# EAGLE schematic TwoMegCoCo_MMU_v1.1 (EAGLE 7.7.0)
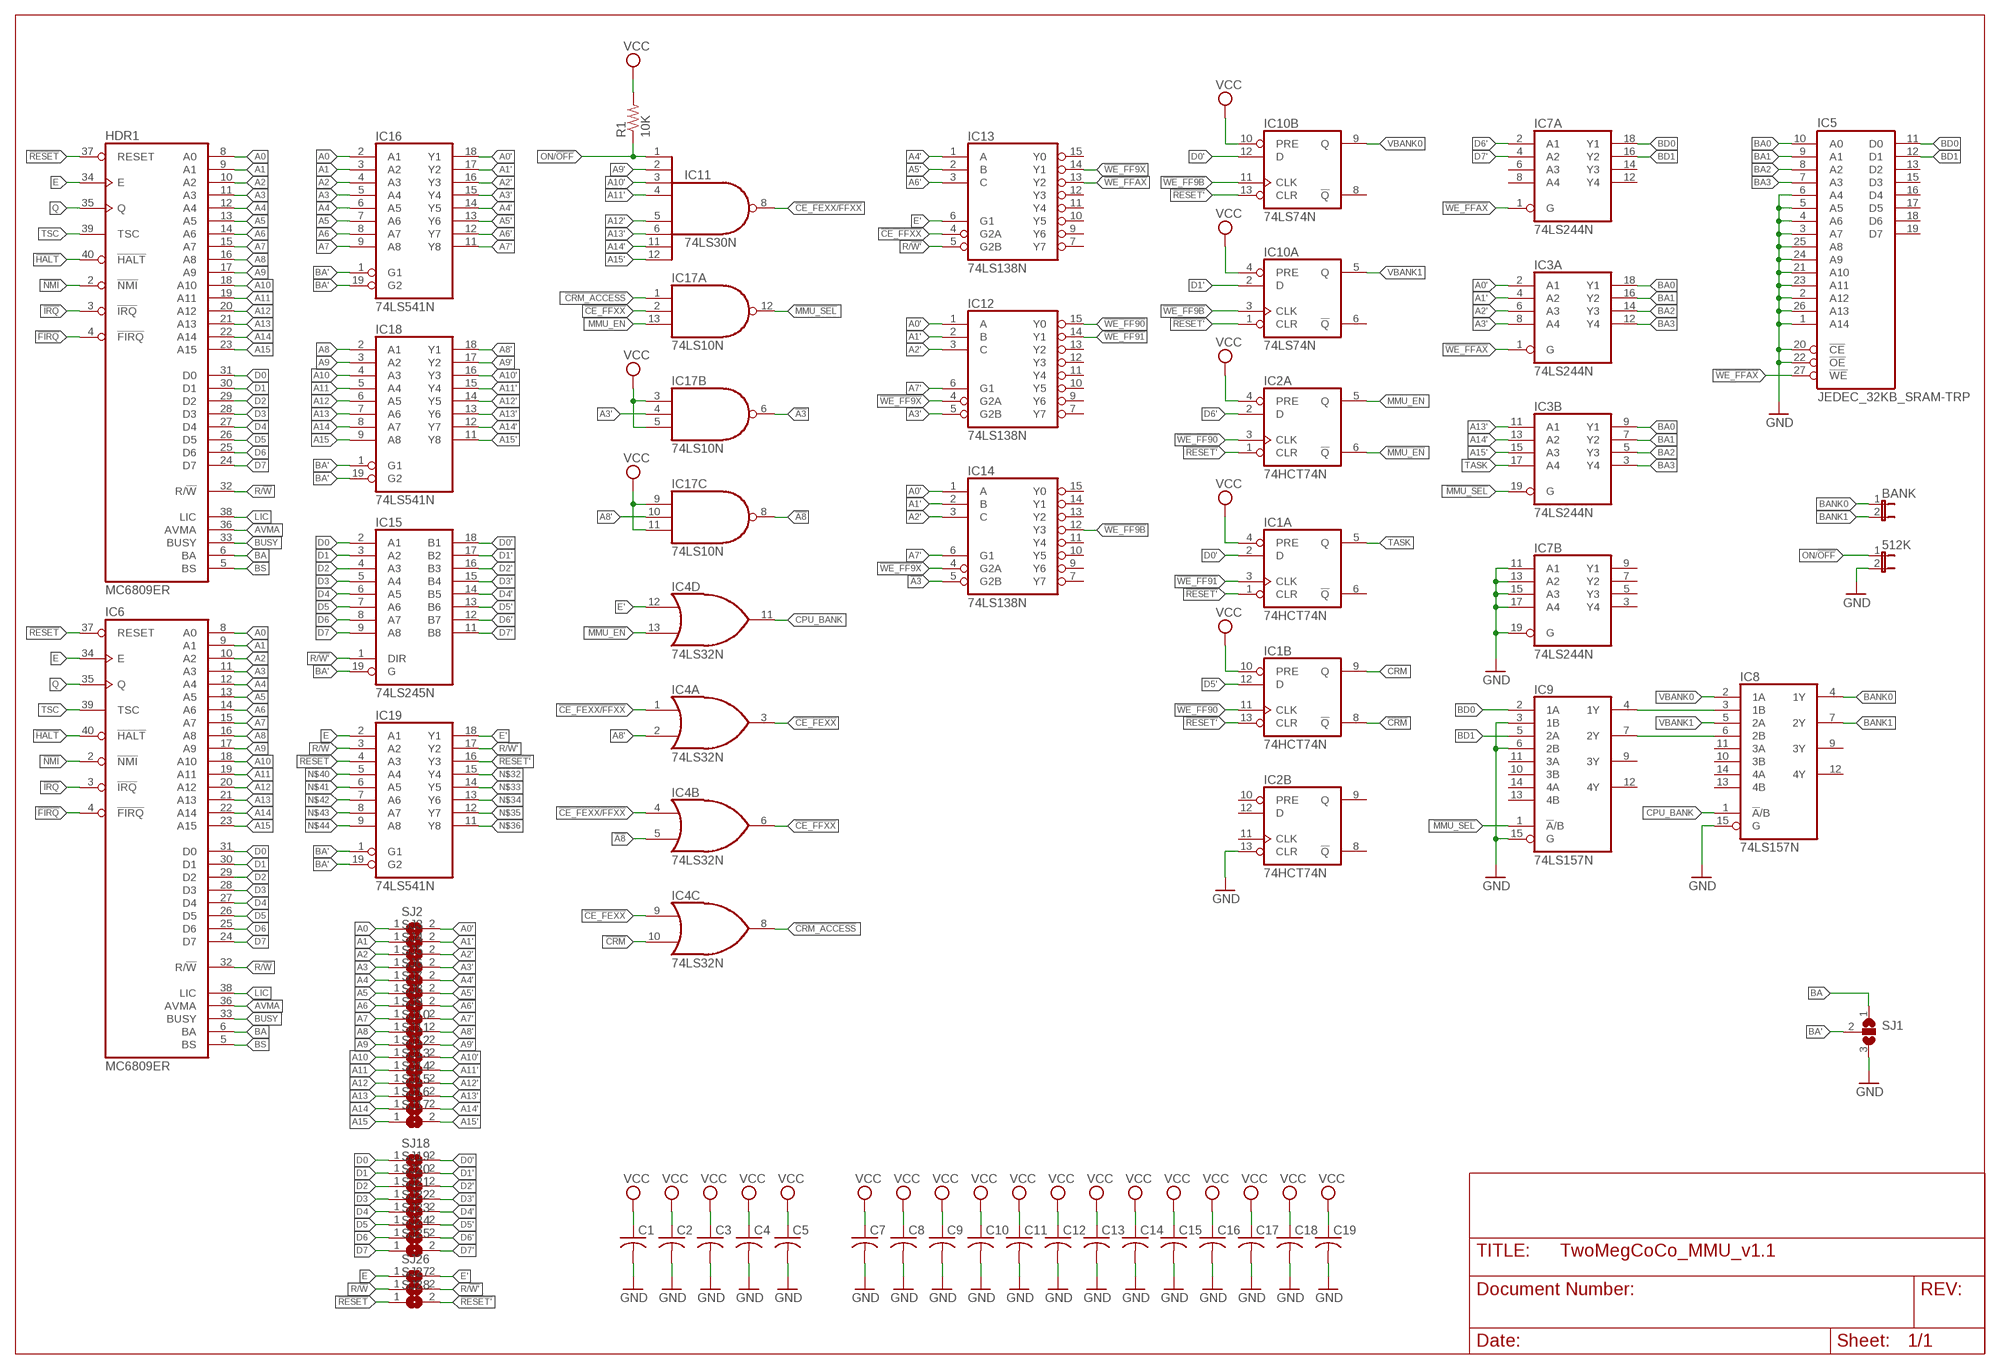
[diagram p0: schematic, sheet 1]

## Parts
512K  JP1E  [JP1]
BANK  JP1E  [JP1]
C1  C-US025-025X050  [C025-025X050]
C2  C-US025-025X050  [C025-025X050]
C3  C-US025-025X050  [C025-025X050]
C4  C-US025-025X050  [C025-025X050]
C5  C-US025-025X050  [C025-025X050]
C7  C-US025-025X050  [C025-025X050]
C8  C-US025-025X050  [C025-025X050]
C9  C-US025-025X050  [C025-025X050]
C10  C-US025-025X050  [C025-025X050]
C11  C-US025-025X050  [C025-025X050]
C12  C-US025-025X050  [C025-025X050]
C13  C-US025-025X050  [C025-025X050]
C14  C-US025-025X050  [C025-025X050]
C15  C-US025-025X050  [C025-025X050]
C16  C-US025-025X050  [C025-025X050]
C17  C-US025-025X050  [C025-025X050]
C18  C-US025-025X050  [C025-025X050]
C19  C-US025-025X050  [C025-025X050]
HDR1  MC6809ER  [DIL40-ROUNDPAD]
IC1  74HCT74N  [DIL14-RP]
IC2  74HCT74N  [DIL14-RP]
IC3  74LS244N  [DIL20-RP]
IC4  74LS32N  [DIL14-RP]
IC5  JEDEC_32KB_SRAM-TRP  [DIL28-3-RP]
IC6  MC6809ER  [DIL40-ROUNDPAD]
IC7  74LS244N  [DIL20-RP]
IC8  74LS157N  [DIL16-RP]
IC9  74LS157N  [DIL16-RP]
IC10  74LS74N  [DIL14-RP]
IC11  74LS30N  [DIL14-RP]
IC12  74LS138N  [DIL16-RP]
IC13  74LS138N  [DIL16-RP]
IC14  74LS138N  [DIL16-RP]
IC15  74LS245N  [DIL20-RP]
IC16  74LS541N  [DIL20-RP]
IC17  74LS10N  [DIL14-RP]
IC18  74LS541N  [DIL20-RP]
IC19  74LS541N  [DIL20-RP]
R1  10K  R-US_0204/7  [0204/7]
SJ1  SJ2W  [SJ_2]
SJ2  SJ  [SJ]
SJ3  SJ  [SJ]
SJ4  SJ  [SJ]
SJ5  SJ  [SJ]
SJ6  SJ  [SJ]
SJ7  SJ  [SJ]
SJ8  SJ  [SJ]
SJ9  SJ  [SJ]
SJ10  SJ  [SJ]
SJ11  SJ  [SJ]
SJ12  SJ  [SJ]
SJ13  SJ  [SJ]
SJ14  SJ  [SJ]
SJ15  SJ  [SJ]
SJ16  SJ  [SJ]
SJ17  SJ  [SJ]
SJ18  SJ  [SJ]
SJ19  SJ  [SJ]
SJ20  SJ  [SJ]
SJ21  SJ  [SJ]
SJ22  SJ  [SJ]
SJ23  SJ  [SJ]
SJ24  SJ  [SJ]
SJ25  SJ  [SJ]
SJ26  SJ  [SJ]
SJ27  SJ  [SJ]
SJ28  SJ  [SJ]

## Nets
!A3: IC14.5(G2B) IC17.6(B:O)
!A8: IC4.5(B:I1) IC17.8(C:O)
!CE_FEXX: IC4.3(A:O) IC4.9(C:I0)
!CE_FEXX/FFXX: IC4.1(A:I0) IC4.4(B:I0) IC11.8(O)
!CE_FFXX: IC4.6(B:O) IC13.4(G2A) IC17.2(A:I1)
!CRM: IC1.8(B:!Q) IC4.10(C:I1)
!CRM_ACCESS: IC4.8(C:O) IC17.1(A:I0)
!FIRQ: HDR1.4(!FIRQ) IC6.4(!FIRQ)
!HALT: HDR1.40(!HALT) IC6.40(!HALT)
!IRQ: HDR1.3(!IRQ) IC6.3(!IRQ)
!MMU_EN: IC2.6(A:!Q) IC4.13(D:I1)
!MMU_SEL: IC3.19(B:G) IC9.1(!A!/B) IC17.12(A:O)
!NMI: HDR1.2(!NMI) IC6.2(!NMI)
!RESET: HDR1.37(RESET) IC6.37(RESET) IC19.4(A3) SJ28.1
!RESET': IC1.1(A:CLR) IC1.13(B:CLR) IC2.1(A:CLR) IC10.1(A:CLR) IC10.13(B:CLR) IC19.16(Y3) SJ28.2
!WE_FF9B: IC10.3(A:CLK) IC10.11(B:CLK) IC14.12(Y3)
!WE_FF9X: IC12.4(G2A) IC13.14(Y1) IC14.4(G2A)
!WE_FF90: IC1.11(B:CLK) IC2.3(A:CLK) IC12.15(Y0)
!WE_FF91: IC1.3(A:CLK) IC12.14(Y1)
!WE_FFAX: IC3.1(A:G) IC5.27(!WE) IC7.1(A:G) IC13.13(Y2)
A0: HDR1.8(A0) IC6.8(A0) IC16.2(A1) SJ2.1
A0': IC3.2(A:A1) IC12.1(A) IC14.1(A) IC16.18(Y1) SJ2.2
A1: HDR1.9(A1) IC6.9(A1) IC16.3(A2) SJ3.1
A1': IC3.4(A:A2) IC12.2(B) IC14.2(B) IC16.17(Y2) SJ3.2
A2: HDR1.10(A2) IC6.10(A2) IC16.4(A3) SJ4.1
A2': IC3.6(A:A3) IC12.3(C) IC14.3(C) IC16.16(Y3) SJ4.2
A3: HDR1.11(A3) IC6.11(A3) IC16.5(A4) SJ5.1
A3': IC3.8(A:A4) IC12.5(G2B) IC16.15(Y4) IC17.4(B:I1) SJ5.2
A4: HDR1.12(A4) IC6.12(A4) IC16.6(A5) SJ6.1
A4': IC13.1(A) IC16.14(Y5) SJ6.2
A5: HDR1.13(A5) IC6.13(A5) IC16.7(A6) SJ7.1
A5': IC13.2(B) IC16.13(Y6) SJ7.2
A6: HDR1.14(A6) IC6.14(A6) IC16.8(A7) SJ8.1
A6': IC13.3(C) IC16.12(Y7) SJ8.2
A7: HDR1.15(A7) IC6.15(A7) IC16.9(A8) SJ9.1
A7': IC12.6(G1) IC14.6(G1) IC16.11(Y8) SJ9.2
A8: HDR1.16(A8) IC6.16(A8) IC18.2(A1) SJ10.1
A8': IC4.2(A:I1) IC17.10(C:I1) IC18.18(Y1) SJ10.2
A9: HDR1.17(A9) IC6.17(A9) IC18.3(A2) SJ11.1
A9': IC11.2(I1) IC18.17(Y2) SJ11.2
A10: HDR1.18(A10) IC6.18(A10) IC18.4(A3) SJ12.1
A10': IC11.3(I2) IC18.16(Y3) SJ12.2
A11: HDR1.19(A11) IC6.19(A11) IC18.5(A4) SJ13.1
A11': IC11.4(I3) IC18.15(Y4) SJ13.2
A12: HDR1.20(A12) IC6.20(A12) IC18.6(A5) SJ14.1
A12': IC11.5(I4) IC18.14(Y5) SJ14.2
A13: HDR1.21(A13) IC6.21(A13) IC18.7(A6) SJ15.1
A13': IC3.11(B:A1) IC11.6(I5) IC18.13(Y6) SJ15.2
A14: HDR1.22(A14) IC6.22(A14) IC18.8(A7) SJ16.1
A14': IC3.13(B:A2) IC11.11(I6) IC18.12(Y7) SJ16.2
A15: HDR1.23(A15) IC6.23(A15) IC18.9(A8) SJ17.1
A15': IC3.15(B:A3) IC11.12(I7) IC18.11(Y8) SJ17.2
AVMA: HDR1.36(AVMA) IC6.36(AVMA)
BA: HDR1.6(BA) IC6.6(BA) SJ1.1
BA0: IC3.9(B:Y1) IC3.18(A:Y1) IC5.10(A0)
BA1: IC3.7(B:Y2) IC3.16(A:Y2) IC5.9(A1)
BA2: IC3.5(B:Y3) IC3.14(A:Y3) IC5.8(A2)
BA3: IC3.3(B:Y4) IC3.12(A:Y4) IC5.7(A3)
BA': IC15.19(G) IC16.1(G1) IC16.19(G2) IC18.1(G1) IC18.19(G2) IC19.1(G1) IC19.19(G2) SJ1.2
BANK0: BANK.1 IC8.4(1Y)
BANK1: BANK.2 IC8.7(2Y)
BD0: IC5.11(D0) IC7.18(A:Y1) IC9.2(1A)
BD1: IC5.12(D1) IC7.16(A:Y2) IC9.5(2A)
BS: HDR1.5(BS) IC6.5(BS)
BUSY: HDR1.33(BUSY) IC6.33(BUSY)
CPU_BANK: IC4.11(D:O) IC8.1(!A!/B)
CRM: IC1.9(B:Q)
D0: HDR1.31(D0) IC6.31(D0) IC15.2(A1) SJ18.1
D0': IC1.2(A:D) IC10.12(B:D) IC15.18(B1) SJ18.2
D1: HDR1.30(D1) IC6.30(D1) IC15.3(A2) SJ19.1
D1': IC10.2(A:D) IC15.17(B2) SJ19.2
D2: HDR1.29(D2) IC6.29(D2) IC15.4(A3) SJ20.1
D2': IC15.16(B3) SJ20.2
D3: HDR1.28(D3) IC6.28(D3) IC15.5(A4) SJ21.1
D3': IC15.15(B4) SJ21.2
D4: HDR1.27(D4) IC6.27(D4) IC15.6(A5) SJ22.1
D4': IC15.14(B5) SJ22.2
D5: HDR1.26(D5) IC6.26(D5) IC15.7(A6) SJ23.1
D5': IC1.12(B:D) IC15.13(B6) SJ23.2
D6: HDR1.25(D6) IC6.25(D6) IC15.8(A7) SJ24.1
D6': IC2.2(A:D) IC7.2(A:A1) IC15.12(B7) SJ24.2
D7: HDR1.24(D7) IC6.24(D7) IC15.9(A8) SJ25.1
D7': IC7.4(A:A2) IC15.11(B8) SJ25.2
E: HDR1.34(E) IC6.34(E) IC19.2(A1) SJ26.1
E': IC4.12(D:I0) IC13.6(G1) IC19.18(Y1) SJ26.2
GND: 512K.2 C1.2 C2.2 C3.2 C4.2 C5.2 C7.2 C8.2 C9.2 C10.2 C11.2 C12.2 C13.2 C14.2 C15.2 C16.2 C17.2 C18.2 C19.2 IC2.13(B:CLR) IC5.1(A14) IC5.2(A12) IC5.3(A7) IC5.4(A6) IC5.5(A5) IC5.6(A4) IC5.20(!CE) IC5.21(A10) IC5.22(!OE) IC5.23(A11) IC5.24(A9) IC5.25(A8) IC5.26(A13) IC7.11(B:A1) IC7.13(B:A2) IC7.15(B:A3) IC7.17(B:A4) IC7.19(B:G) IC8.15(G) IC9.3(1B) IC9.6(2B) IC9.15(G) SJ1.3
LIC: HDR1.38(LIC) IC6.38(LIC)
MMU_EN: IC2.5(A:Q) IC17.13(A:I2)
N$1: IC8.3(1B) IC9.4(1Y)
N$2: IC8.6(2B) IC9.7(2Y)
N$32: IC19.15(Y4)
N$33: IC19.14(Y5)
N$34: IC19.13(Y6)
N$35: IC19.12(Y7)
N$36: IC19.11(Y8)
N$40: IC19.5(A4)
N$41: IC19.6(A5)
N$42: IC19.7(A6)
N$43: IC19.8(A7)
N$44: IC19.9(A8)
ON/!OFF: 512K.1 IC11.1(I0) R1.1
Q: HDR1.35(Q) IC6.35(Q)
R/!W: HDR1.32(R/!W) IC6.32(R/!W) IC19.3(A2) SJ27.1
R/!W': IC13.5(G2B) IC15.1(DIR) IC19.17(Y2) SJ27.2
TASK: IC1.5(A:Q) IC3.17(B:A4)
TSC: HDR1.39(TSC) IC6.39(TSC)
VBANK0: IC8.2(1A) IC10.9(B:Q)
VBANK1: IC8.5(2A) IC10.5(A:Q)
VCC: C1.1 C2.1 C3.1 C4.1 C5.1 C7.1 C8.1 C9.1 C10.1 C11.1 C12.1 C13.1 C14.1 C15.1 C16.1 C17.1 C18.1 C19.1 IC1.4(A:PRE) IC1.10(B:PRE) IC2.4(A:PRE) IC10.4(A:PRE) IC10.10(B:PRE) IC17.3(B:I0) IC17.5(B:I2) IC17.9(C:I0) IC17.11(C:I2) R1.2
Unconnected: IC1.6(A:!Q) IC2.8(B:!Q) IC2.9(B:Q) IC2.10(B:PRE) IC2.11(B:CLK) IC2.12(B:D) IC5.13(D2) IC5.15(D3) IC5.16(D4) IC5.17(D5) IC5.18(D6) IC5.19(D7) IC7.3(B:Y4) IC7.5(B:Y3) IC7.6(A:A3) IC7.7(B:Y2) IC7.8(A:A4) IC7.9(B:Y1) IC7.12(A:Y4) IC7.14(A:Y3) IC8.9(3Y) IC8.10(3B) IC8.11(3A) IC8.12(4Y) IC8.13(4B) IC8.14(4A) IC9.9(3Y) IC9.10(3B) IC9.11(3A) IC9.12(4Y) IC9.13(4B) IC9.14(4A) IC10.6(A:!Q) IC10.8(B:!Q) IC12.7(Y7) IC12.9(Y6) IC12.10(Y5) IC12.11(Y4) IC12.12(Y3) IC12.13(Y2) IC13.7(Y7) IC13.9(Y6) IC13.10(Y5) IC13.11(Y4) IC13.12(Y3) IC13.15(Y0) IC14.7(Y7) IC14.9(Y6) IC14.10(Y5) IC14.11(Y4) IC14.13(Y2) IC14.14(Y1) IC14.15(Y0)

## Power pins joined to a net without a drawn wire
GND: IC1.7(P:GND) IC2.7(P:GND) IC3.10(P:GND) IC4.7(P:GND) IC5.14(GND) IC7.10(P:GND) IC8.8(GND) IC9.8(GND) IC10.7(P:GND) IC11.7(GND) IC12.8(GND) IC13.8(GND) IC14.8(GND) IC15.10(GND) IC16.10(GND) IC17.7(P:GND) IC18.10(GND) IC19.10(GND)
VCC: HDR1.7(VCC) IC1.14(P:VCC) IC2.14(P:VCC) IC3.20(P:VCC) IC4.14(P:VCC) IC5.28(VCC) IC6.7(VCC) IC7.20(P:VCC) IC8.16(VCC) IC9.16(VCC) IC10.14(P:VCC) IC11.14(VCC) IC12.16(VCC) IC13.16(VCC) IC14.16(VCC) IC15.20(VCC) IC16.20(VCC) IC17.14(P:VCC) IC18.20(VCC) IC19.20(VCC)
VSS: HDR1.1(VSS) IC6.1(VSS)

## Library data of the parts
512K BANK = jumper-jlb:JP1E: JUMPER
C1-C5 C7-C19 = resistor:C-US: CAPACITOR, American symbol
HDR1 IC6 = micro-motorola:MC6809E: MICROCONTROLLER/MEMORY DEVICE
IC1 IC2 IC10 = 74xx-us-jlb:74*74: Dual D type positive edge triggered FLIP FLOP, preset and clear
IC3 IC7 = 74xx-us-jlb:74*244: Octal BUFFER and LINE DRIVER, 3-state
IC4 = 74xx-us-jlb:74*32: Quad 2-input OR gate
IC5 = memory-jedec-jlb:JEDEC_32KB_SRAM: MEMORY
IC8 IC9 = 74xx-us-jlb:74*157: Quadruple 2-line to 1-line data SELECTOR/MULTIPLEXER
IC11 = 74xx-us-jlb:74*30: 8-input NAND gate
IC12-IC14 = 74xx-us-jlb:74*138: 3-line to 8-line DECODER/DEMULTIPLEXER
IC15 = 74xx-us-jlb:74*245: Octal BUS TRANSCEIVER, 3-state
IC16 IC18 IC19 = 74xx-us-jlb:74*541: Octal BUFFER and LINE DRIVER, 3-state
IC17 = 74xx-us-jlb:74*10: Triple 3-input NAND gate
R1 = resistor:R-US_: RESISTOR, American symbol
SJ1 = jumper:SJ2W: SMD solder JUMPER
SJ2-SJ28 = jumper:SJ: SMD solder JUMPER